# Altium schematic sheet [02] - BLOCK DIAGRAM.SchDoc
size A3; CompanyName: FPT-FTI copporation; Address1: FPT Building Duy Tan; Address2: Floor 4,; DocumentNumber: 2; SheetNumber: 2; SheetTotal: 13; NameAuthor: Angle Vu
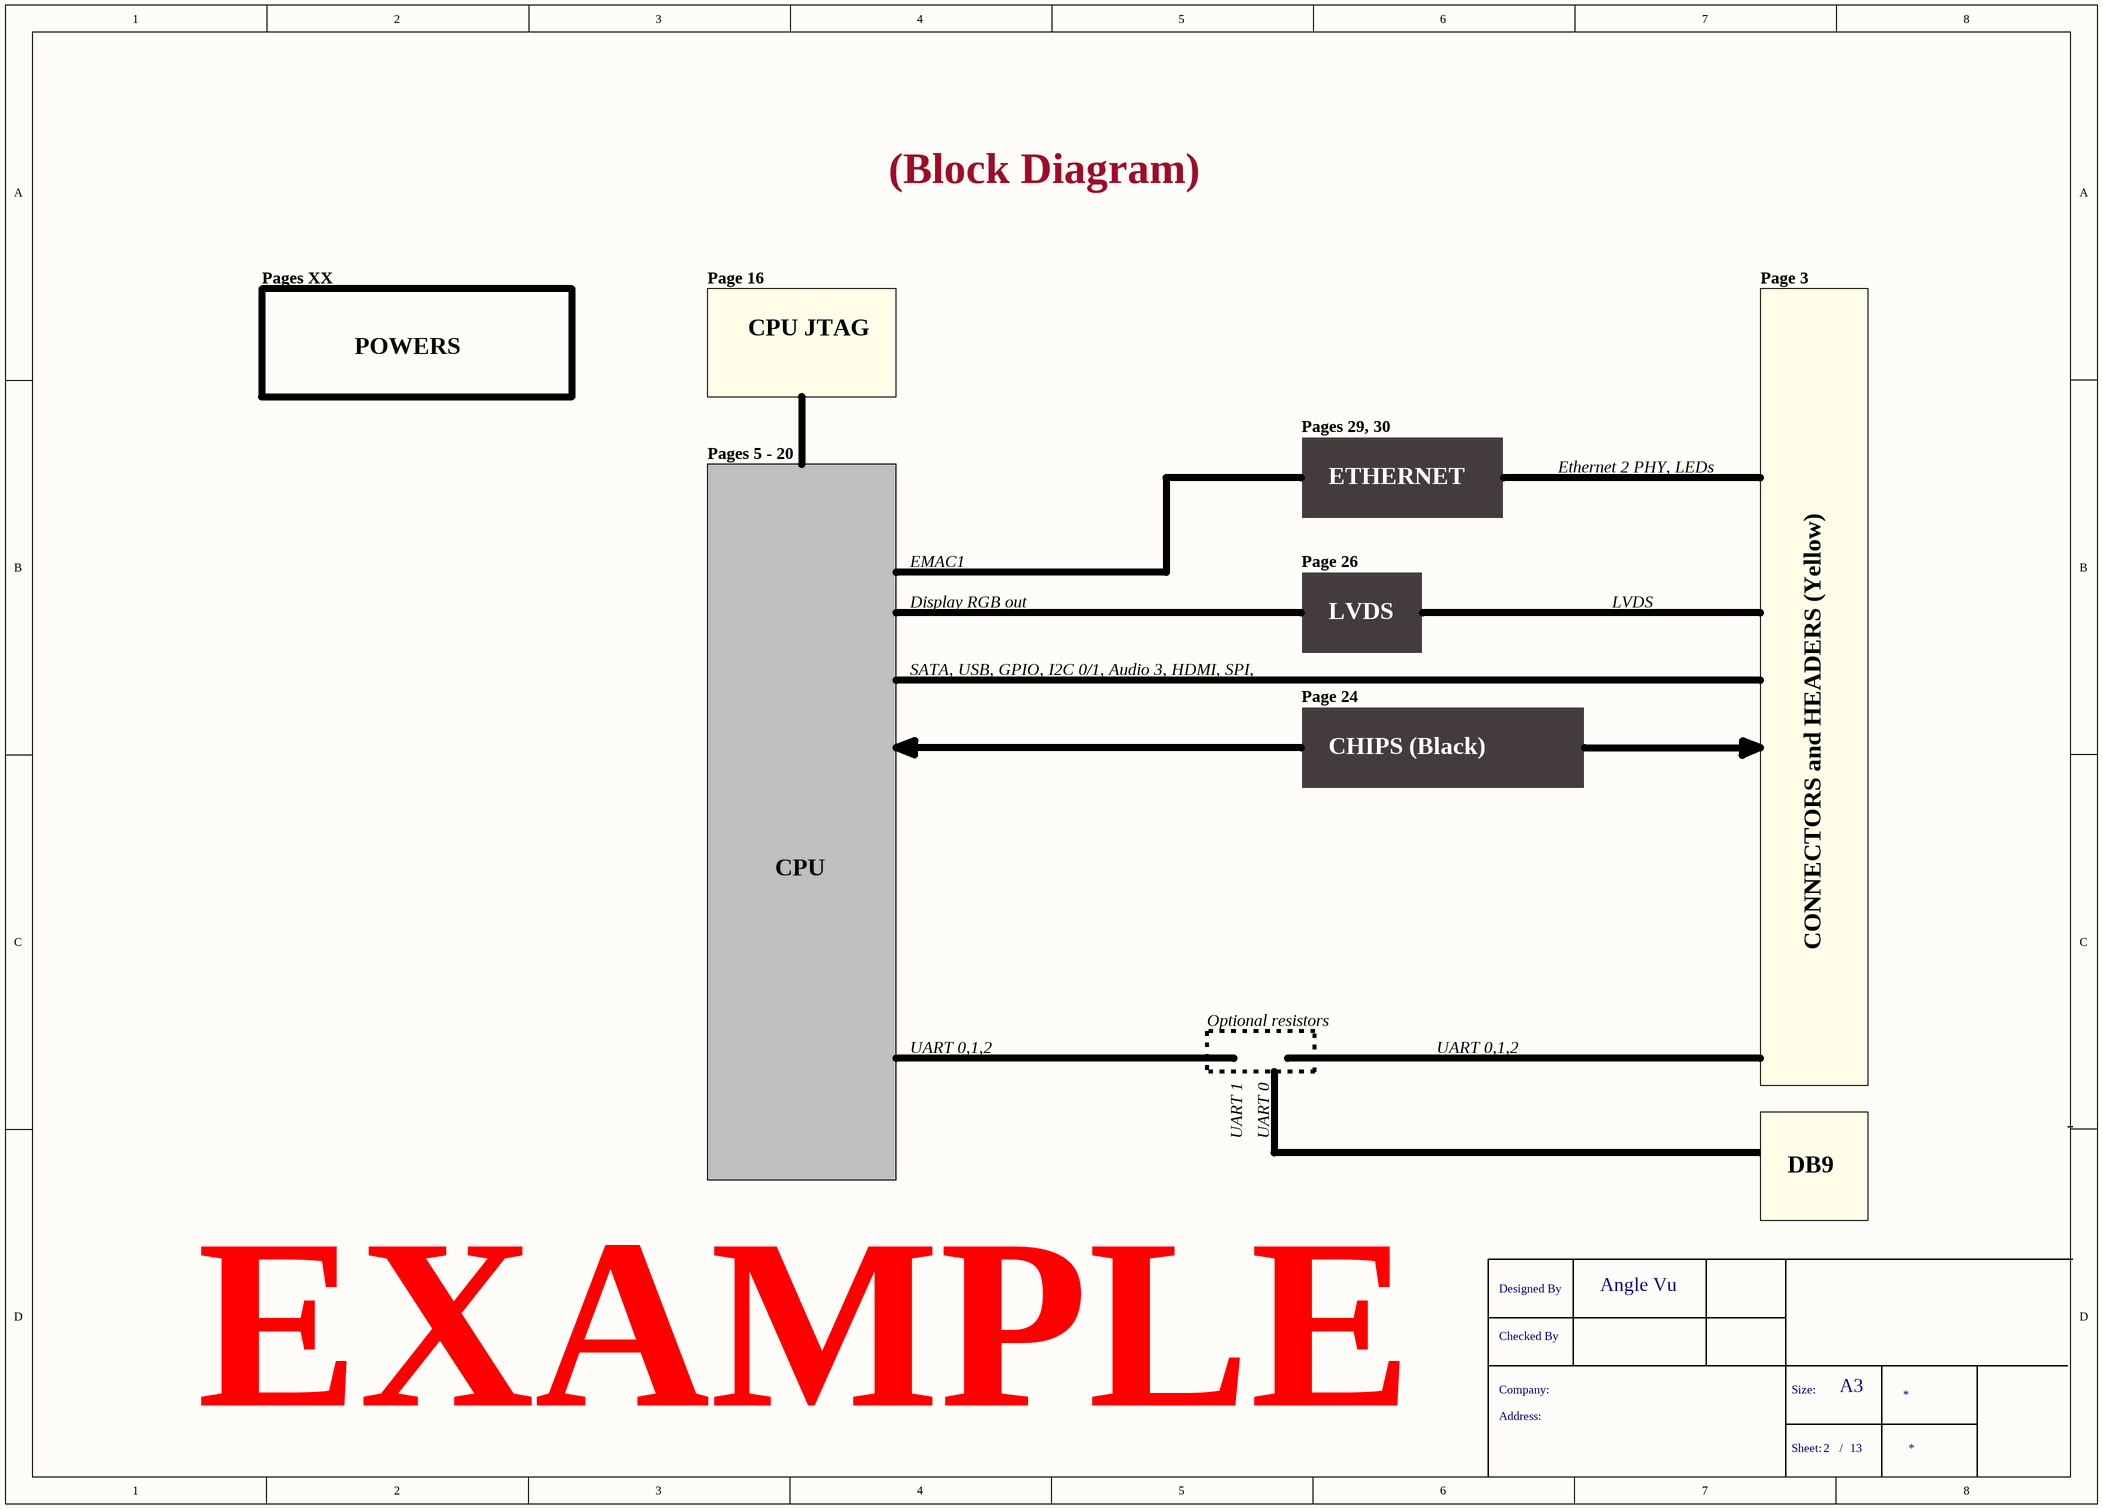
[diagram p0: [02] - BLOCK DIAGRAM.SchDoc]

## Notes on the sheet
- (Block Diagram)
- Pages XX
- Page 16
- Page 3
- POWERS
- CPU JTAG
- Pages 29, 30
- Pages 5 - 20
- ETHERNET
- Ethernet 2 PHY, LEDs
- EMAC1
- Page 26
- Display RGB out
- LVDS
- SATA, USB, GPIO, I2C 0/1, Audio 3, HDMI, SPI,
- Page 24
- CHIPS (Black)
- CPU
- CONNECTORS and HEADERS (Yellow)
- UART 0,1,2
- Optional resistors
- FPGA
- UART 1
- UART 0
- DB9
- CLOCKS (CPU & PCIE)
- EXAMPLE
- Designed By
- Checked By
- Company:
- Size:
- A3
- Address:
- Sheet:
- /